# EAGLE design IR prijimac (EAGLE 5.06)
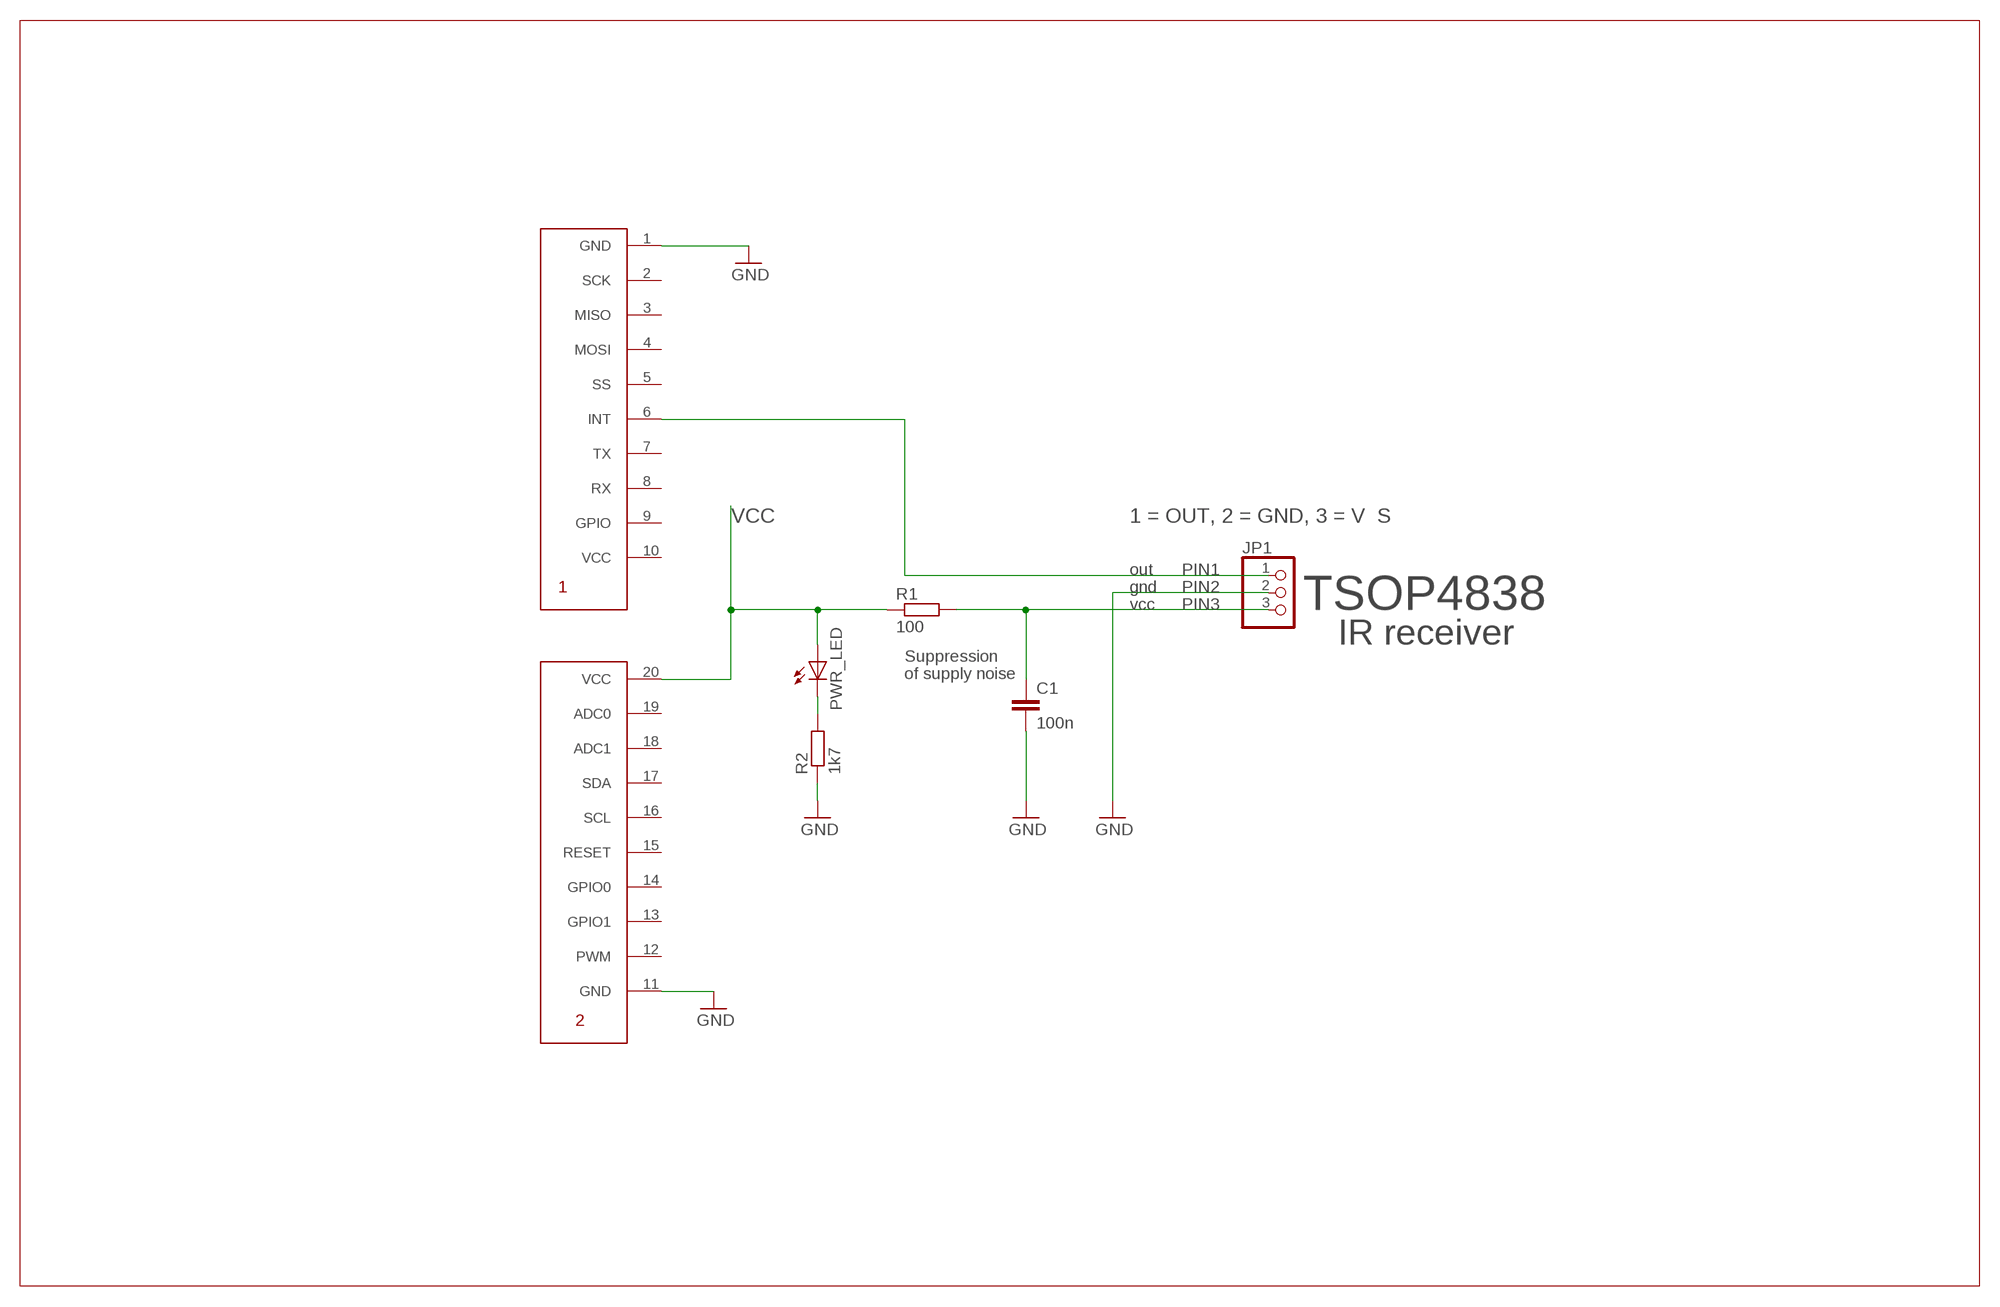
[diagram p0: schematic, sheet 1]

## Parts
C1  100n  C-EU050-024X044  [C050-024X044]
JP1  PINHD-1X03_2.54  [1X03]
MM1  MMSYS_CONECTOR  [MMSYSTEMS_CON]
PWR_LED  LED3MM  [LED3MM]
R1  100  R-EU_0207/10  [0207/10]
R2  1k7  R-EU_0207/10  [0207/10]

## Nets
GND: C1.2 JP1.2 MM1.1(GND) MM1.11(GND) R2.1
N$1: PWR_LED.K(C) R2.2
PIN1: JP1.1 MM1.6(INT)
PIN3: C1.1 JP1.3 R1.2
VCC: MM1.20(VCC) PWR_LED.A R1.1
Unconnected: MM1.2(SCK) MM1.3(MISO) MM1.4(MOSI) MM1.5(SS) MM1.7(TX) MM1.8(RX) MM1.9(GPIO) MM1.10(VCC) MM1.12(PWM) MM1.13(GPIO1) MM1.14(GPIO0) MM1.15(RESET) MM1.16(SCL) MM1.17(SDA) MM1.18(ADC1) MM1.19(ADC0)

## Notes on the sheet
- 1 = OUT, 2 = GND, 3 = V  S
- out
- gnd | PIN2
- vcc | TSOP4838
- IR receiver
- Suppression
- of supply noise

## Library data of the parts
C1 = resistor:C-EU: CAPACITOR, European symbol
JP1 = acon-tyco (19):PINHD-1X03: PIN HEADER
MM1 = atmega16u4:MMSYS_CONECTOR
PWR_LED = led:LED: LED OSRAM: - CHIPLED LG R971, LG N971, LY N971, LG Q971, LY Q971, LO R971, LY R971 LH N974, LH R974 LS Q976, LO Q976, LY Q976 LO Q996 - Hyper CHIPLED LW Q18S LB Q993, LB Q99A, LB R99A - SideLED LS A670, LO A670, LY A670, LG A670, LP A670 LB A673, LV A673, LT A673, LW A673 LH A674 LY A675 LS A676, LA A676, LO A676, LY A676, LW A676 LS A679, LY A679, LG A679 - Hyper Micro SIDELED® LS Y876, LA Y876, LO Y876, LY Y876 LT Y87S - SmartLED LW L88C, LW L88S LB L89C, LB L89S, LG L890 LS L89K, LO L89K, LY L89K LS L896, LA L896, LO L896, LY L896 - TOPLED LS T670, LO T670, LY T670, LG T670, LP T670 LSG T670, LSP T670, LSY T670, LOP T670, LYG T670 LG T671, LOG T671, LSG T671 LB T673, LV T673, LT T673, LW T673 LH T674 LS T676, LA T676, LO T676, LY T676, LB T676, LH T676, LSB T676, LW T676 LB T67C, LV T67C, LT T67C, LS T67K, LO T67K, LY T67K, LW E67C LS E67B, LA E67B, LO E67B, LY E67B, LB E67C, LV E67C, LT E67C LW T67C LS T679, LY T679, LG T679 LS T770, LO T770, LY T770, LG T770, LP T770 LB T773, LV T773, LT T773, LW T773 LH T774 LS E675, LA E675, LY E675, LS T675 LS T776, LA T776, LO T776, LY T776, LB T776 LHGB T686 LT T68C, LB T68C - Hyper Mini TOPLED® LB M676 - Mini TOPLED Santana® LG M470 LS M47K, LO M47K, LY M47K Source: http://www.osram.convergy.de LUXEON: - LUMILED® LXK2-PW12-R00, LXK2-PW12-S00, LXK2-PW14-U00, LXK2-PW14-V00 LXK2-PM12-R00, LXK2-PM12-S00, LXK2-PM14-U00 LXK2-PE12-Q00, LXK2-PE12-R00, LXK2-PE12-S00, LXK2-PE14-T00, LXK2-PE14-U00 LXK2-PB12-K00, LXK2-PB12-L00, LXK2-PB12-M00, LXK2-PB14-N00, LXK2-PB14-P00, LXK2-PB14-Q00 LXK2-PR12-L00, LXK2-PR12-M00, LXK2-PR14-Q00, LXK2-PR14-R00 LXK2-PD12-Q00, LXK2-PD12-R00, LXK2-PD12-S00 LXK2-PH12-R00, LXK2-PH12-S00 LXK2-PL12-P00, LXK2-PL12-Q00, LXK2-PL12-R00 Source: www.luxeon.com KINGBRIGHT: KA-3528ASYC Source: www.kingbright.com
R1 R2 = resistor:R-EU_: RESISTOR, European symbol

## Board
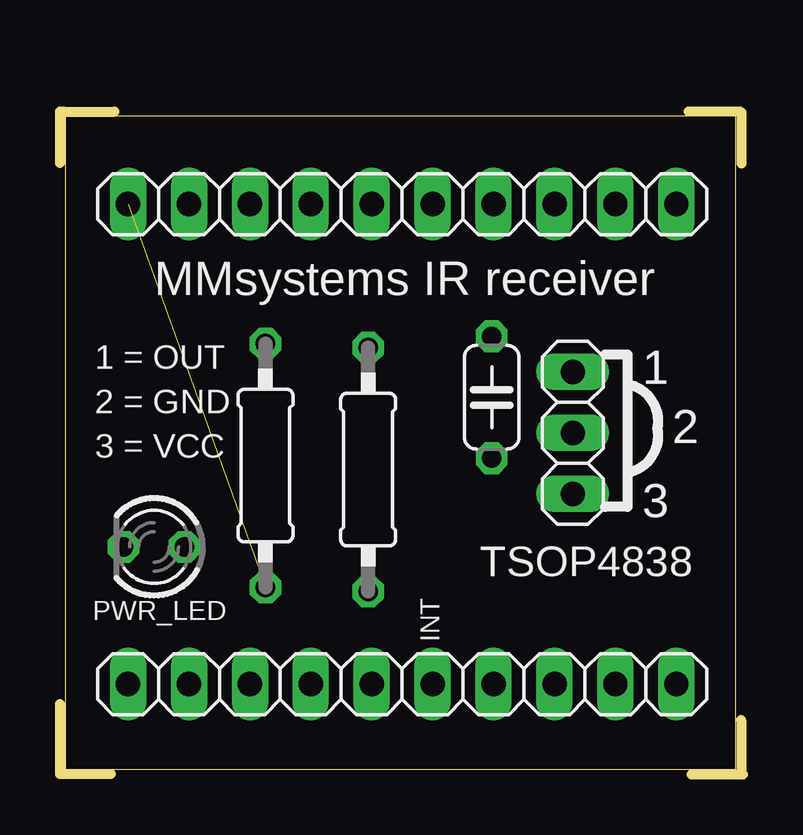
[diagram p1: board, top side]
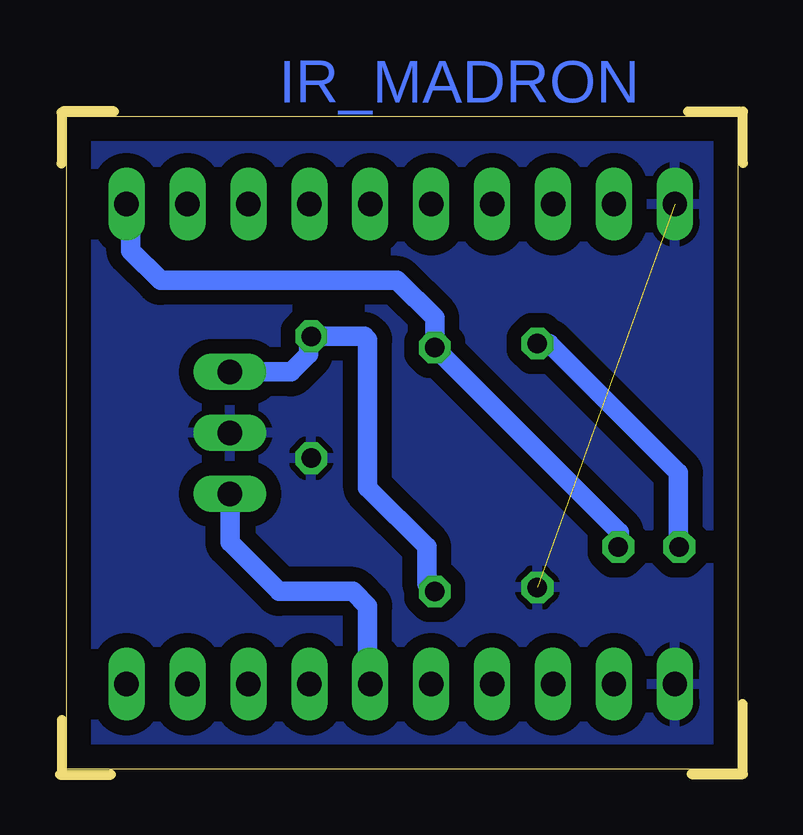
[diagram p2: board, bottom side, seen from below]

Size 28.47 x 27.63 mm. Coordinates in mm from the lower left corner, seen from the top.
Outline: 2.13,0.02 0,0.02 0.01,2.94
Outline: 28.47,0 26.34,0
Outline: 28.4,2.27 28.4,0.14
Outline: 28.41,27.58 28.41,25.45
Outline: 26.22,27.63 28.35,27.63
Outline: 0.15,27.62 2.28,27.62
Outline: 0,25.49 0,27.62
Outline: 0.22,0.23 28.18,0.23 28.18,27.42 0.22,27.42 0.22,0.23
Copper layers (1*16): Top 0.035mm / dielectric 1.5mm / Bottom 0.035mm
Design rules "default": minimum track width 10mil, minimum drill 24mil, track to track 8mil, track to pad 8mil, pad to pad 8mil, via to via 8mil, smd to smd 8mil, copper to edge 40mil, drill to drill 8mil, minimum pad ring 10mil, minimum via ring 8mil, stop-mask expansion 4mil, vias tented up to drill 0mil, thermal gap 10mil

### Footprints (pad centres in the part's own frame; a part is rotated, then mirrored left to right if it is on the bottom)
C050-024X044 = drill 0.813 octagon: 1 -2.54,0; 2 2.54,0
1X03 = drill 1.016 long: 1 -2.54,0; 2 0,0; 3 2.54,0
MMSYSTEMS_CON = drill 1.016 long: 1 2,1; 2 4.54,1; 3 7.08,1; 4 9.62,1; 5 12.16,1; 6 14.7,1; 7 17.24,1; 8 19.78,1; 9 22.32,1; 10 24.86,1; 11 2,21; 12 4.54,21; 13 7.08,21; 14 9.62,21; 15 12.16,21; 16 14.7,21; 17 17.24,21; 18 19.78,21; 19 22.32,21; 20 24.86,21
LED3MM = drill 0.813 octagon: A -1.27,0; K 1.27,0
0207/10 = drill 0.813 octagon: 1 -5.08,0; 2 5.08,0

### Placement (x,y rotation side)
C1  18,15.72 270 top
JP1  21.38,14.24 90 top
MM1  0.84,2.77 0 top
PWR_LED  3.92,9.49 180 top
R1  12.85,12.71 270 top
R2  8.57,12.88 90 top

### Tracks (layer width: path | path; a pad name or v marks a point on that pad's centre or on a via)
GND  (1 unrouted)
  pour Bottom (isolate 0.61): -1.63,-1.62 -1.63,29.23 29.84,29.23 29.84,-1.62
N$1
  Bottom 0.813: R2.2 8.07,17.96 2.69,12.57 2.69,9.52 PWR_LED.K
PIN1
  Bottom 0.813: JP1.1 21.38,9.67 19.35,7.63 16.26,7.63 15.65,7.02 15.65,3.88 MM1.6
PIN3
  Bottom 0.813: JP1.3 18.84,16.78 18.11,17.51 18.11,18.15 C1.1 15.78,18.26 15.65,18.12 15.65,11.95 13.18,9.49 13.18,7.96 R1.2
VCC
  Bottom 0.813: MM1.20 25.52,23.59 25.52,21.82 24.28,20.59 14.41,20.59 12.85,19.03 R1.1 5.16,10.1 5.16,9.52 PWR_LED.A

### Text on the board
Bottom: IR_MADRON
tNames: MMsystems IR receiver | 1 = OUT | 1 | 2 = GND | 2 | 3 = VCC | 3 | TSOP4838 | INT